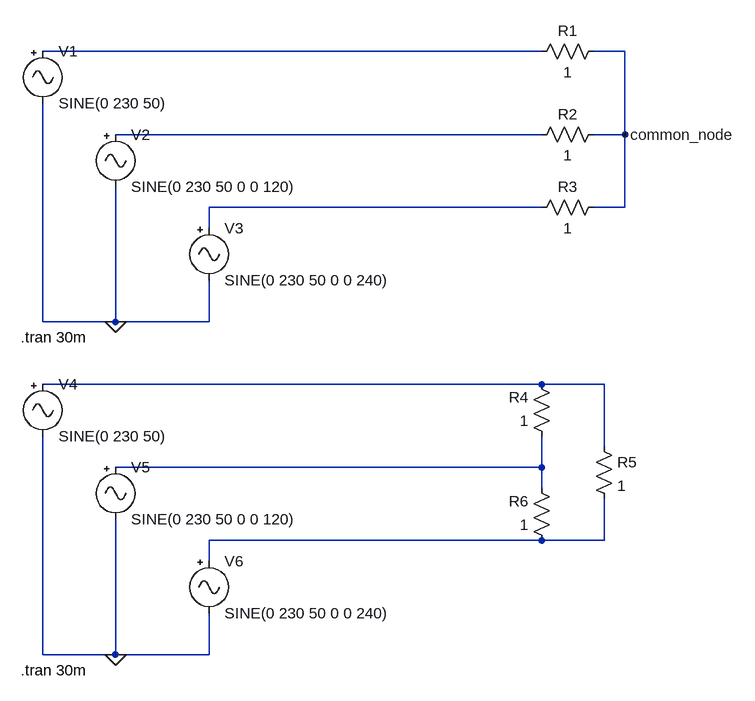
[diagram p0: schematic three-phase.asc]
three-phase.asc, the LTspice schematic file:
Version 4
SHEET 1 1128 984
WIRE 864 16 96 16
WIRE 992 16 944 16
WIRE 864 144 208 144
WIRE 992 144 992 16
WIRE 992 144 944 144
WIRE 864 256 352 256
WIRE 992 256 992 144
WIRE 992 256 944 256
WIRE 352 288 352 256
WIRE 96 432 96 96
WIRE 208 432 208 224
WIRE 208 432 96 432
WIRE 352 432 352 368
WIRE 352 432 208 432
WIRE 864 528 96 528
WIRE 960 528 864 528
WIRE 960 624 960 528
WIRE 864 656 864 608
WIRE 864 656 208 656
WIRE 864 688 864 656
WIRE 864 768 352 768
WIRE 960 768 960 704
WIRE 960 768 864 768
WIRE 352 800 352 768
WIRE 96 944 96 608
WIRE 208 944 208 736
WIRE 208 944 96 944
WIRE 352 944 352 880
WIRE 352 944 208 944
FLAG 208 432 0
FLAG 208 944 0
FLAG 992 144 common_node
SYMBOL Misc\\signal 96 0 R0
WINDOW 123 0 0 Left 0
WINDOW 39 0 0 Left 0
SYMATTR InstName V1
SYMATTR Value SINE(0 230 50)
SYMBOL Misc\\signal 208 128 R0
WINDOW 123 0 0 Left 0
WINDOW 39 0 0 Left 0
SYMATTR InstName V2
SYMATTR Value SINE(0 230 50 0 0 120)
SYMBOL Misc\\signal 352 272 R0
WINDOW 123 0 0 Left 0
WINDOW 39 0 0 Left 0
SYMATTR InstName V3
SYMATTR Value SINE(0 230 50 0 0 240)
SYMBOL res 960 0 R90
WINDOW 0 0 56 VBottom 2
WINDOW 3 32 56 VTop 2
SYMATTR InstName R1
SYMATTR Value 1
SYMBOL res 960 128 R90
WINDOW 0 0 56 VBottom 2
WINDOW 3 32 56 VTop 2
SYMATTR InstName R2
SYMATTR Value 1
SYMBOL res 960 240 R90
WINDOW 0 0 56 VBottom 2
WINDOW 3 32 56 VTop 2
SYMATTR InstName R3
SYMATTR Value 1
SYMBOL Misc\\signal 96 512 R0
WINDOW 123 0 0 Left 0
WINDOW 39 0 0 Left 0
SYMATTR InstName V4
SYMATTR Value SINE(0 230 50)
SYMBOL Misc\\signal 208 640 R0
WINDOW 123 0 0 Left 0
WINDOW 39 0 0 Left 0
SYMATTR InstName V5
SYMATTR Value SINE(0 230 50 0 0 120)
SYMBOL Misc\\signal 352 784 R0
WINDOW 123 0 0 Left 0
WINDOW 39 0 0 Left 0
SYMATTR InstName V6
SYMATTR Value SINE(0 230 50 0 0 240)
SYMBOL res 880 624 R180
WINDOW 0 36 76 Left 2
WINDOW 3 36 40 Left 2
SYMATTR InstName R4
SYMATTR Value 1
SYMBOL res 944 608 R0
SYMATTR InstName R5
SYMATTR Value 1
SYMBOL res 880 784 R180
WINDOW 0 36 76 Left 2
WINDOW 3 36 40 Left 2
SYMATTR InstName R6
SYMATTR Value 1
TEXT 62 456 Left 2 !.tran 30m
TEXT 62 968 Left 2 !.tran 30m

The netlist it stands for:
* three-phase.asc
V1 N001 0 SINE(0 230 50)
V2 N002 0 SINE(0 230 50 0 0 120)
V3 N003 0 SINE(0 230 50 0 0 240)
R1 common_node N001 1
R2 common_node N002 1
R3 common_node N003 1
V4 N004 0 SINE(0 230 50)
V5 N005 0 SINE(0 230 50 0 0 120)
V6 N006 0 SINE(0 230 50 0 0 240)
R4 N005 N004 1
R5 N004 N006 1
R6 N006 N005 1
.tran 30m
.tran 30m
.backanno
.end